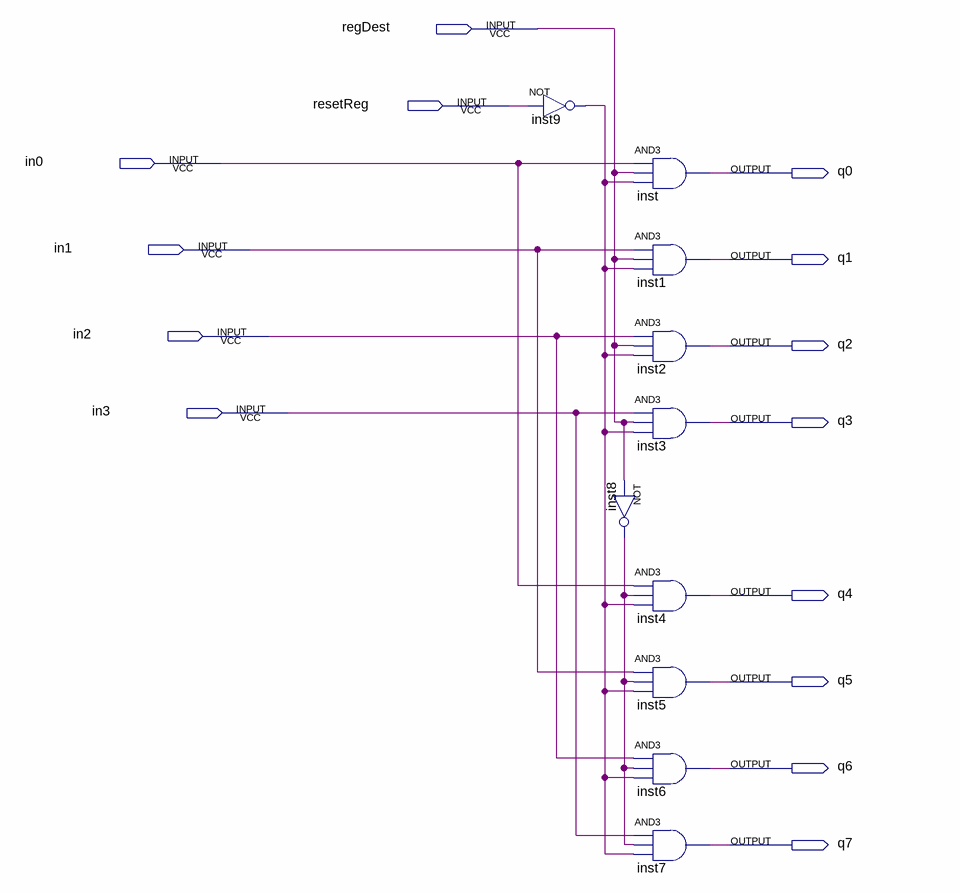
[diagram p0: schematic sheet]
// Quartus schematic reg_dest1.bdf as structural Verilog: 10 symbols, 14 pins
module reg_dest1 (
  input  regDest,
  input  resetReg,
  input  in0,
  input  in1,
  input  in2,
  input  in3,
  output q0,
  output q1,
  output q2,
  output q3,
  output q4,
  output q5,
  output q6,
  output q7
);

  wire inst8_out, inst9_out;

  not inst9 (inst9_out, resetReg);
  and inst (q0, in0, regDest, inst9_out);
  and inst1 (q1, in1, regDest, inst9_out);
  and inst2 (q2, in2, regDest, inst9_out);
  and inst3 (q3, in3, regDest, inst9_out);
  not inst8 (inst8_out, regDest);
  and inst4 (q4, in0, inst8_out, inst9_out);
  and inst5 (q5, in1, inst8_out, inst9_out);
  and inst6 (q6, in2, inst8_out, inst9_out);
  and inst7 (q7, in3, inst8_out, inst9_out);
endmodule
